# Altium schematic sheet 11 mPCIe CONN.SchDoc
size 513 x 386 mm
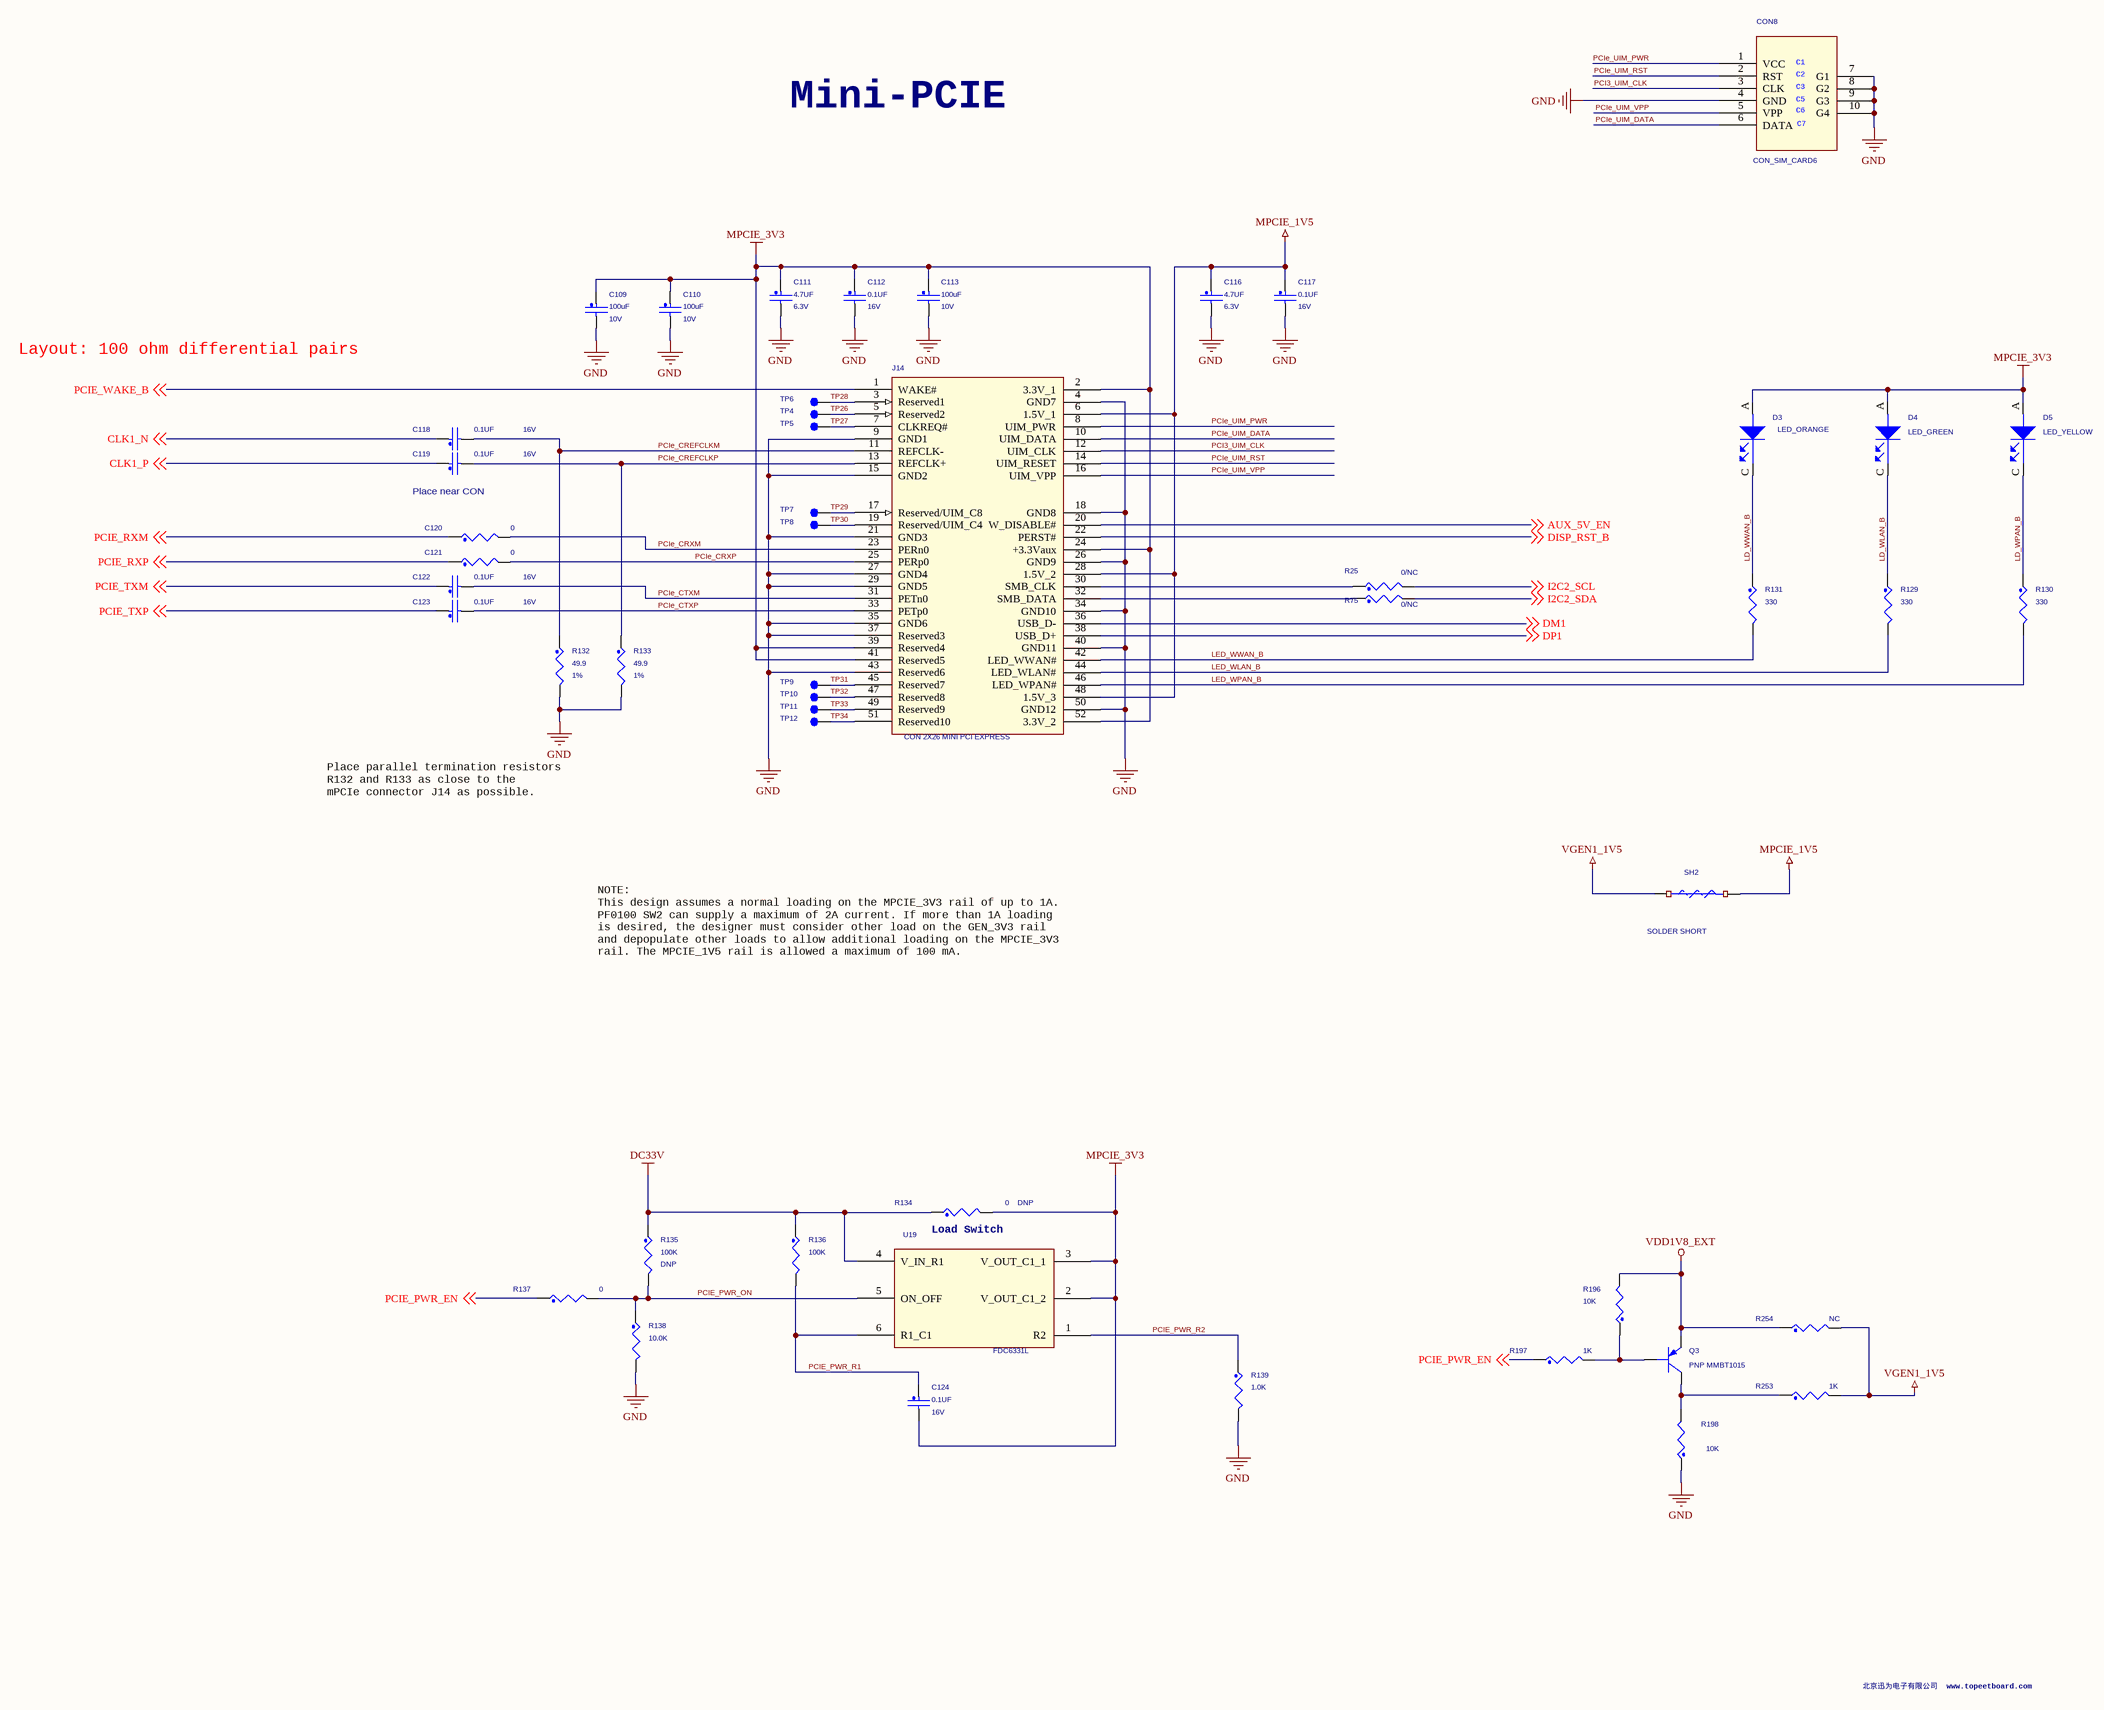
[diagram p0: 11 mPCIe CONN.SchDoc]

## Parts
C109  100uF  WVDC: 10V  [C1206]
C110  100uF  WVDC: 10V  [C1206]
C111  4.7UF  WVDC: 6.3V  [C0603]
C112  0.1UF  WVDC: 16V  [C0402]
C113  100uF  WVDC: 10V  [C1206]
C116  4.7UF  WVDC: 6.3V  [C0603]
C117  0.1UF  WVDC: 16V  [C0402]
C118  0.1UF  WVDC: 16V  [C0402]
C119  0.1UF  WVDC: 16V  [C0402]
C120  0  [C0402]
C121  0  [C0402]
C122  0.1UF  WVDC: 16V  [C0402]
C123  0.1UF  WVDC: 16V  [C0402]
C124  0.1UF  WVDC: 16V  [C0402]
CON8  CON_SIM_CARD6  [SIM_CARD6]
D3  LED_ORANGE  [LED0603]
D4  LED_GREEN  [LED0603]
D5  LED_YELLOW  [LED0603]
J14  CON 2X26 MINI PCI EXPRESS  [con_2x26_0p8_smt_a2]
Q3  PNP MMBT1015  [SOT-23]
R25  0/NC  [R0402]
R75  0/NC  [R0402]
R129  330  [R0402]
R130  330  [R0402]
R131  330  [R0402]
R132  49.9  Tolerance: 1%  [R0402]
R133  49.9  Tolerance: 1%  [R0402]
R134  0  ASSY_OPT: DNP  [R0402]
R135  100K  ASSY_OPT: DNP  [R0402]
R136  100K  [R0402]
R137  0  [R0402]
R138  10.0K  [R0402]
R139  1.0K  [R0402]
R196  10K  [R0402]
R197  1K  [R0402]
R198  10K  [R0402]
R253  1K  [R0402]
R254  NC  [R0402]
SH2  SOLDER SHORT  [SH0805_40]
TP4  TEST POINT  [C035S]  (value not drawn)
TP5  TEST POINT  [C035S]  (value not drawn)
TP6  TEST POINT  [C035S]  (value not drawn)
TP7  TEST POINT  [C035S]  (value not drawn)
TP8  TEST POINT  [C035S]  (value not drawn)
TP9  TEST POINT  [C035S]  (value not drawn)
TP10  TEST POINT  [C035S]  (value not drawn)
TP11  TEST POINT  [C035S]  (value not drawn)
TP12  TEST POINT  [C035S]  (value not drawn)
U19  FDC6331L  [ssot6_1p7x3]

## Nets
DC33V: R134.1 R135.1 R136.1 U19.4(V_IN_R1)
GND: C109.2 C110.2 C111.2 C112.2 C113.2 C116.2 C117.2 CON8.4(GND) CON8.7(G1) CON8.8(G2) CON8.9(G3) CON8.10(G4) J14.4(GND7) J14.9(GND1) J14.15(GND2) J14.18(GND8) J14.21(GND3) J14.26(GND9) J14.27(GND4) J14.29(GND5) J14.34(GND10) J14.35(GND6) J14.37(Reserved3) J14.40(GND11) J14.43(Reserved6) J14.50(GND12) R132.2 R133.2 R138.2 R139.2 R198.1
MPCIE_1V5: C116.1 C117.1 J14.6(1.5V_1) J14.28(1.5V_2) J14.48(1.5V_3) SH2.2
MPCIE_3V3: C109.1 C110.1 C111.1 C112.1 C113.1 C124.2 D3.A(ANODE) D4.A(ANODE) D5.A(ANODE) J14.2(3.3V_1) J14.24(+3.3Vaux) J14.39(Reserved4) J14.41(Reserved5) J14.52(3.3V_2) R134.2 U19.2(V_OUT_C1_2) U19.3(V_OUT_C1_1)
VDD1V8_EXT: Q3.1(E) R196.2 R254.1
VGEN1_1V5: R253.2 R254.2 SH2.1
AUX_5V_EN: J14.20(W_DISABLE#) ; off-sheet AUX_5V_EN
CLK1_N: C118.1 ; off-sheet CLK1_N
CLK1_P: C119.1 ; off-sheet CLK1_P
DISP_RST_B: J14.22(PERST#) ; off-sheet DISP_RST_B
DM1: J14.36(USB_D-) ; off-sheet DM1
DP1: J14.38(USB_D+) ; off-sheet DP1
I2C2_SCL: R25.2 ; off-sheet I2C2_SCL
I2C2_SDA: R75.2 ; off-sheet I2C2_SDA
LD_WLAN_B: D4.C(CATHODE) R129.1
LD_WPAN_B: D5.C(CATHODE) R130.1
LD_WWAN_B: D3.C(CATHODE) R131.1
LED_WLAN_B: J14.44(LED_WLAN#) R129.2
LED_WPAN_B: J14.46(LED_WPAN#) R130.2
LED_WWAN_B: J14.42(LED_WWAN#) R131.2
PCI3_UIM_CLK: CON8.3(CLK) J14.12(UIM_CLK)
PCIe_CREFCLKM: C118.2 J14.11(REFCLK-) R132.1
PCIe_CREFCLKP: C119.2 J14.13(REFCLK+) R133.1
PCIe_CRXM: C120.2 J14.23(PERn0)
PCIe_CRXP: C121.2 J14.25(PERp0)
PCIe_CTXM: C122.2 J14.31(PETn0)
PCIe_CTXP: C123.2 J14.33(PETp0)
PCIE_PWR_EN: R137.1 R197.1 ; off-sheet PCIE_PWR_EN
PCIE_PWR_ON: R135.2 R137.2 R138.1 U19.5(ON_OFF)
PCIE_PWR_R1: C124.1 R136.2 U19.6(R1_C1)
PCIE_PWR_R2: R139.1 U19.1(R2)
PCIE_RXM: C120.1 ; off-sheet PCIE_RXM
PCIE_RXP: C121.1 ; off-sheet PCIE_RXP
PCIE_TXM: C122.1 ; off-sheet PCIE_TXM
PCIE_TXP: C123.1 ; off-sheet PCIE_TXP
PCIe_UIM_DATA: CON8.6(DATA) J14.10(UIM_DATA)
PCIe_UIM_PWR: CON8.1(VCC) J14.8(UIM_PWR)
PCIe_UIM_RST: CON8.2(RST) J14.14(UIM_RESET)
PCIe_UIM_VPP: CON8.5(VPP) J14.16(UIM_VPP)
PCIE_WAKE_B: J14.1(WAKE#) ; off-sheet PCIE_WAKE_B
TP26: J14.5(Reserved2) TP4.1(Pin1)
TP27: J14.7(CLKREQ#) TP5.1(Pin1)
TP28: J14.3(Reserved1) TP6.1(Pin1)
TP29: J14.17(Reserved/UIM_C8) TP7.1(Pin1)
TP30: J14.19(Reserved/UIM_C4) TP8.1(Pin1)
TP31: J14.45(Reserved7) TP9.1(Pin1)
TP32: J14.47(Reserved8) TP10.1(Pin1)
TP33: J14.49(Reserved9) TP11.1(Pin1)
TP34: J14.51(Reserved10) TP12.1(Pin1)
NetJ14_30: J14.30(SMB_CLK) R25.1
NetJ14_32: J14.32(SMB_DATA) R75.1
NetQ3_2: Q3.2(C) R198.2 R253.1
NetQ3_3: Q3.3(B) R196.1 R197.2

## Notes on the sheet
- Mini-PCIE
- Layout: 100 ohm differential pairs
- Place near CON
- Place parallel termination resistors
  R132 and R133 as close to the
  mPCIe connector J14 as possible.
- NOTE:
  This design assumes a normal loading on the MPCIE_3V3 rail of up to 1A.
  PF0100 SW2 can supply a maximum of 2A current. If more than 1A loading
  is desired, the designer must consider other load on the GEN_3V3 rail
  and depopulate other loads to allow additional loading on the MPCIE_3V3
  rail. The MPCIE_1V5 rail is allowed a maximum of 100 mA.
- (near R134) Load Switch
- 北京迅为电子有限公司  www.topeetboard.com
- (in symbol CON_SIM_CARD6_2) C1; C2; C3; C5; C6; C7

## Library data of the parts
C109 C110 = CAP_NP: CAP CER 100uF 10V 20% X5R 1206; FPLIST: CC1206_OV,CC1206,1206_CC; CAD_APPROVED: Yes; MFG_PN01: C3216X5R1A107M; MFG_NAME01: TDK; AGILE_PN: 150-78880; HEIGHT: 1.9MM; ROHS: Yes; Tolerance: 20%; VOLTAGE: 10V
C111 = CAP_NP: CAP CER 4.7UF 6.3V 10% X5R 0603; PRIORITY_PN: 021-00280; FPLIST: CC0603_OV,CC0603,0603_CC; CAD_APPROVED: Yes; MFG_PN01: C0603X5R6R3-475KNP; MFG_NAME01: VENKEL COMPANY; AGILE_PN: 150-75487; SIGNAL_MODEL: DEFAULT_CAPACITOR_4.7e+06pF_2_1; VOLTAGE: 6.3V; HEIGHT: 1.016MM; ROHS: Yes; Tolerance: 10%
C112 C118 C122 C123 = CAP_NP: CAP CER 0.1UF 16V 10% X7R 0402; AGILE_PN: 150-75182; MFG_NAME01: KEMET; MFG_PN01: C0402C104K4RAC; CAD_APPROVED: Yes; FPLIST: CC0402_25,CC0402_HD,0402_CC; PRIORITY_PN: 021-00196; SIGNAL_MODEL: DEFAULT_CAPACITOR_100000pF_2_1; VOLTAGE: 16V; Tolerance: 10%; ROHS: Yes; HEIGHT: 0.635MM
C113 = CAP_NP: CAP CER 100uF 10V 20% X5R 1206; SIGNAL_MODEL: DEFAULT_CAPACITOR_1e+08pF_2_1; FPLIST: CC1206_OV,CC1206,1206_CC; CAD_APPROVED: Yes; MFG_PN01: C3216X5R1A107M; MFG_NAME01: TDK; AGILE_PN: 150-78880; HEIGHT: 1.9MM; ROHS: Yes; Tolerance: 20%; VOLTAGE: 10V
C116 = CAP_NP: CAP CER 4.7UF 6.3V 10% X5R 0603; AGILE_PN: 150-75487; MFG_NAME01: VENKEL COMPANY; MFG_PN01: C0603X5R6R3-475KNP; CAD_APPROVED: Yes; FPLIST: CC0603_OV,CC0603,0603_CC; PRIORITY_PN: 021-00280; SIGNAL_MODEL: DEFAULT_CAPACITOR_4.7e+06pF_2_1; VOLTAGE: 6.3V; Tolerance: 10%; ROHS: Yes; HEIGHT: 1.016MM
C117 C119 = CAP_NP: CAP CER 0.1UF 16V 10% X7R 0402; PRIORITY_PN: 021-00196; FPLIST: CC0402_25,CC0402_HD,0402_CC; CAD_APPROVED: Yes; MFG_PN01: C0402C104K4RAC; MFG_NAME01: KEMET; AGILE_PN: 150-75182; SIGNAL_MODEL: DEFAULT_CAPACITOR_100000pF_2_1; VOLTAGE: 16V; HEIGHT: 0.635MM; ROHS: Yes; Tolerance: 10%
C120 C121 = RES_Dup1: RES MF ZERO OHM 1/10W -- 0402; AGILE_PN: 470-79965; MFG_NAME01: Panasonic; MFG_PN01: ERJ-2GE0R00X; CAD_APPROVED: Yes; FPLIST: RC0402_25,RC0402_HD,RC0402_X2,0402_CC; ROHS: Yes
C124 = CAP_NP: CAP CER 0.1UF 16V 10% X7R 0402; SIGNAL_MODEL: DEFAULT_CAPACITOR_100000pF_2_1; AGILE_PN: 150-75182; MFG_NAME01: KEMET; MFG_PN01: C0402C104K4RAC; CAD_APPROVED: Yes; FPLIST: CC0402_25,CC0402_HD,0402_CC; VOLTAGE: 16V; Tolerance: 10%; ROHS: Yes; HEIGHT: 0.635MM
CON8 = CON_SIM_CARD6_2
D3 = LED: LED SUPER BRIGHT ORANGE SMD 0603; CAD_APPROVED: Yes; MFG_PN01: AP1608SEC; MFG_NAME01: KINGBRIGHT; AGILE_PN: 370-75145; HEIGHT: 1.1MM; ROHS: Yes
D4 = LED: LED ULTRA-BRIGHT GREEN SMT 0603; AGILE_PN: 370-75077; MFG_NAME01: LITE ON; MFG_PN01: LTST-C190KGKT; CAD_APPROVED: Yes; ROHS: Yes; HEIGHT: 0.8MM
D5 = LED: LED ULTRA-BRIGHT YELLOW 30MA 5V SMT 0603; CAD_APPROVED: Yes; MFG_PN01: LTST-C190KSKT; MFG_NAME01: LITE ON; AGILE_PN: 370-75076; HEIGHT: 0.8MM; ROHS: Yes
J14 = MINI_PCI_LATCH_52P: CON 2X26 MINI PCI EXPRESS SMT 0.8MM SP 1136H; AGILE_PN: 211-78711; MFG_NAME01: Molex; MFG_PN01: 679100002; CAD_APPROVED: Yes; ROHS: Yes; HEIGHT: 28.85MM
Q3 = PNP ECB
R25 R75 R131 = RES_Dup1: RES MF 330 OHM 1/16W 1% AEC-Q200 0402; SIGNAL_MODEL: DEFAULT_RESISTOR_330OHM_2_1; AGILE_PN: 470-76465; MFG_NAME01: KOA SPEER; MFG_PN01: RK73H1ETTP3300F; CAD_APPROVED: Yes; FPLIST: RC0402_25,RC0402_HD,0402_CC; Tolerance: 1%; ROHS: Yes
R129 R130 = RES_Dup1: RES MF 330 OHM 1/16W 1% AEC-Q200 0402; SIGNAL_MODEL: DEFAULT_RESISTOR_330OHM_2_1; FPLIST: RC0402_25,RC0402_HD,0402_CC; CAD_APPROVED: Yes; MFG_PN01: RK73H1ETTP3300F; MFG_NAME01: KOA SPEER; AGILE_PN: 470-76465; ROHS: Yes; Tolerance: 1%
R132 R133 = RES_Dup1: RES MF 49.9 OHM 1/16W 1% 0402; SIGNAL_MODEL: DEFAULT_RESISTOR_49.9OHM_2_1; AGILE_PN: 470-75360; MFG_NAME01: BOURNS; MFG_PN01: CR0402-FX-49R9GLF; CAD_APPROVED: Yes; FPLIST: RC0402_25,RC0402_HD,0402_CC; ROHS: Yes
R134 = RES_Dup1: RES MF ZERO OHM 1/10W -- 0402; FPLIST: RC0402_25,RC0402_HD,RC0402_X2,0402_CC; AGILE_PN: 470-79965; MFG_NAME01: Panasonic; MFG_PN01: ERJ-2GE0R00X; CAD_APPROVED: Yes; PRIORITY_PN: 006-00441; SIGNAL_MODEL: DEFAULT_RESISTOR_0.001OHM_2_1; ROHS: Yes
R135 = RES_Dup1: RES MF 100K 1/16W 1% 0402; PRIORITY_PN: 006-00657; FPLIST: RC0402_25,rc0402_frs; CAD_APPROVED: Yes; MFG_PN01: RC0402FR-07100KL; MFG_NAME01: YAGEO AMERICA; AGILE_PN: 470-76240; SIGNAL_MODEL: DEFAULT_RESISTOR_100000OHM_2_1; Tolerance: 1%; ROHS: Yes
R136 = RES_Dup1: RES MF 100K 1/16W 1% 0402; AGILE_PN: 470-76240; MFG_NAME01: YAGEO AMERICA; MFG_PN01: RC0402FR-07100KL; CAD_APPROVED: Yes; FPLIST: RC0402_25,rc0402_frs; PRIORITY_PN: 006-00657; SIGNAL_MODEL: DEFAULT_RESISTOR_100000OHM_2_1; ROHS: Yes; Tolerance: 1%
R137 R196 R254 = RES_Dup1: RES MF ZERO OHM 1/10W -- 0402; PRIORITY_PN: 006-00559; FPLIST: RC0402_25,RC0402_HD,RC0402_X2,0402_CC; CAD_APPROVED: Yes; MFG_PN01: ERJ-2GE0R00X; MFG_NAME01: Panasonic; AGILE_PN: 470-79965; SIGNAL_MODEL: DEFAULT_RESISTOR_0.001OHM_2_1; ROHS: Yes
R138 = RES_Dup1: RES MF 10.0K 1/16W 1% AEC-Q200 0402; SIGNAL_MODEL: DEFAULT_RESISTOR_10000OHM_2_1; FPLIST: RC0402_25,RC0402_HD,0402_CC; CAD_APPROVED: Yes; MFG_PN01: RK73H1ETTP1002F; MFG_NAME01: KOA SPEER; AGILE_PN: 470-75416; ROHS: Yes; Tolerance: 1%
R139 = RES_Dup1: RES MF 1.0K 1/16W 1% 0402; FPLIST: RC0402_25,RC0402_HD,RC0402_X2,0402_CC; PRIORITY_PN: 006-00553; CAD_APPROVED: Yes; MFG_PN01: RC0402FR-071KL; MFG_NAME01: YAGEO AMERICA; AGILE_PN: 470-76037; SIGNAL_MODEL: DEFAULT_RESISTOR_1000OHM_2_1; ROHS: Yes; Tolerance: 1%
R197 R198 R253 = RES_Dup1: RES MF ZERO OHM 1/10W -- 0402; SIGNAL_MODEL: DEFAULT_RESISTOR_0.001OHM_2_1; AGILE_PN: 470-79965; MFG_NAME01: Panasonic; MFG_PN01: ERJ-2GE0R00X; CAD_APPROVED: Yes; FPLIST: RC0402_25,RC0402_HD,RC0402_X2,0402_CC; PRIORITY_PN: 006-00559; ROHS: Yes
SH2 = RES_SHORT-2: SOLDER SHORT 0805  SMT NO PART TO ORDER; FPLIST: SH0805,SH0805CUST,SH0805_40; CAD_APPROVED: Yes; ASSY_OPT: DNP; MFG_PN01: SOLDER_SHORT_0805; MFG_NAME01: NOTACOMPONENT; AGILE_PN: 470-80202; ROHS: Yes
TP4 TP6 = Test pad: TEST POINT PAD 35 MIL SMT, NO PART TO ORDER; AGILE_PN: 280-75148; MFG_NAME01: NA; ASSY_OPT: DNP; CAD_APPROVED: Yes; MFG_PN01: NA; ROHS: Yes; HEIGHT: 0.1 MM
TP5 TP7-TP12 = Test pad: TEST POINT PAD 35 MIL SMT, NO PART TO ORDER; CAD_APPROVED: Yes; ASSY_OPT: DNP; MFG_PN01: NA; AGILE_PN: 280-75148; HEIGHT: 0.1 MM; ROHS: Yes; MFG_NAME01: NA
U19 = FDC6331L: IC LOAD SW 2.5-8V SSOT6; CAD_APPROVED: Yes; MFG_NAME01: Fairchild; AGILE_PN: 315-78829; PRIORITY_PN: 051-FDC6331L; HEIGHT: 1.1MM; ROHS: Yes; MFG_PN01: FDC6331L